# EAGLE schematic MultiDrop (EAGLE 7.6.0)
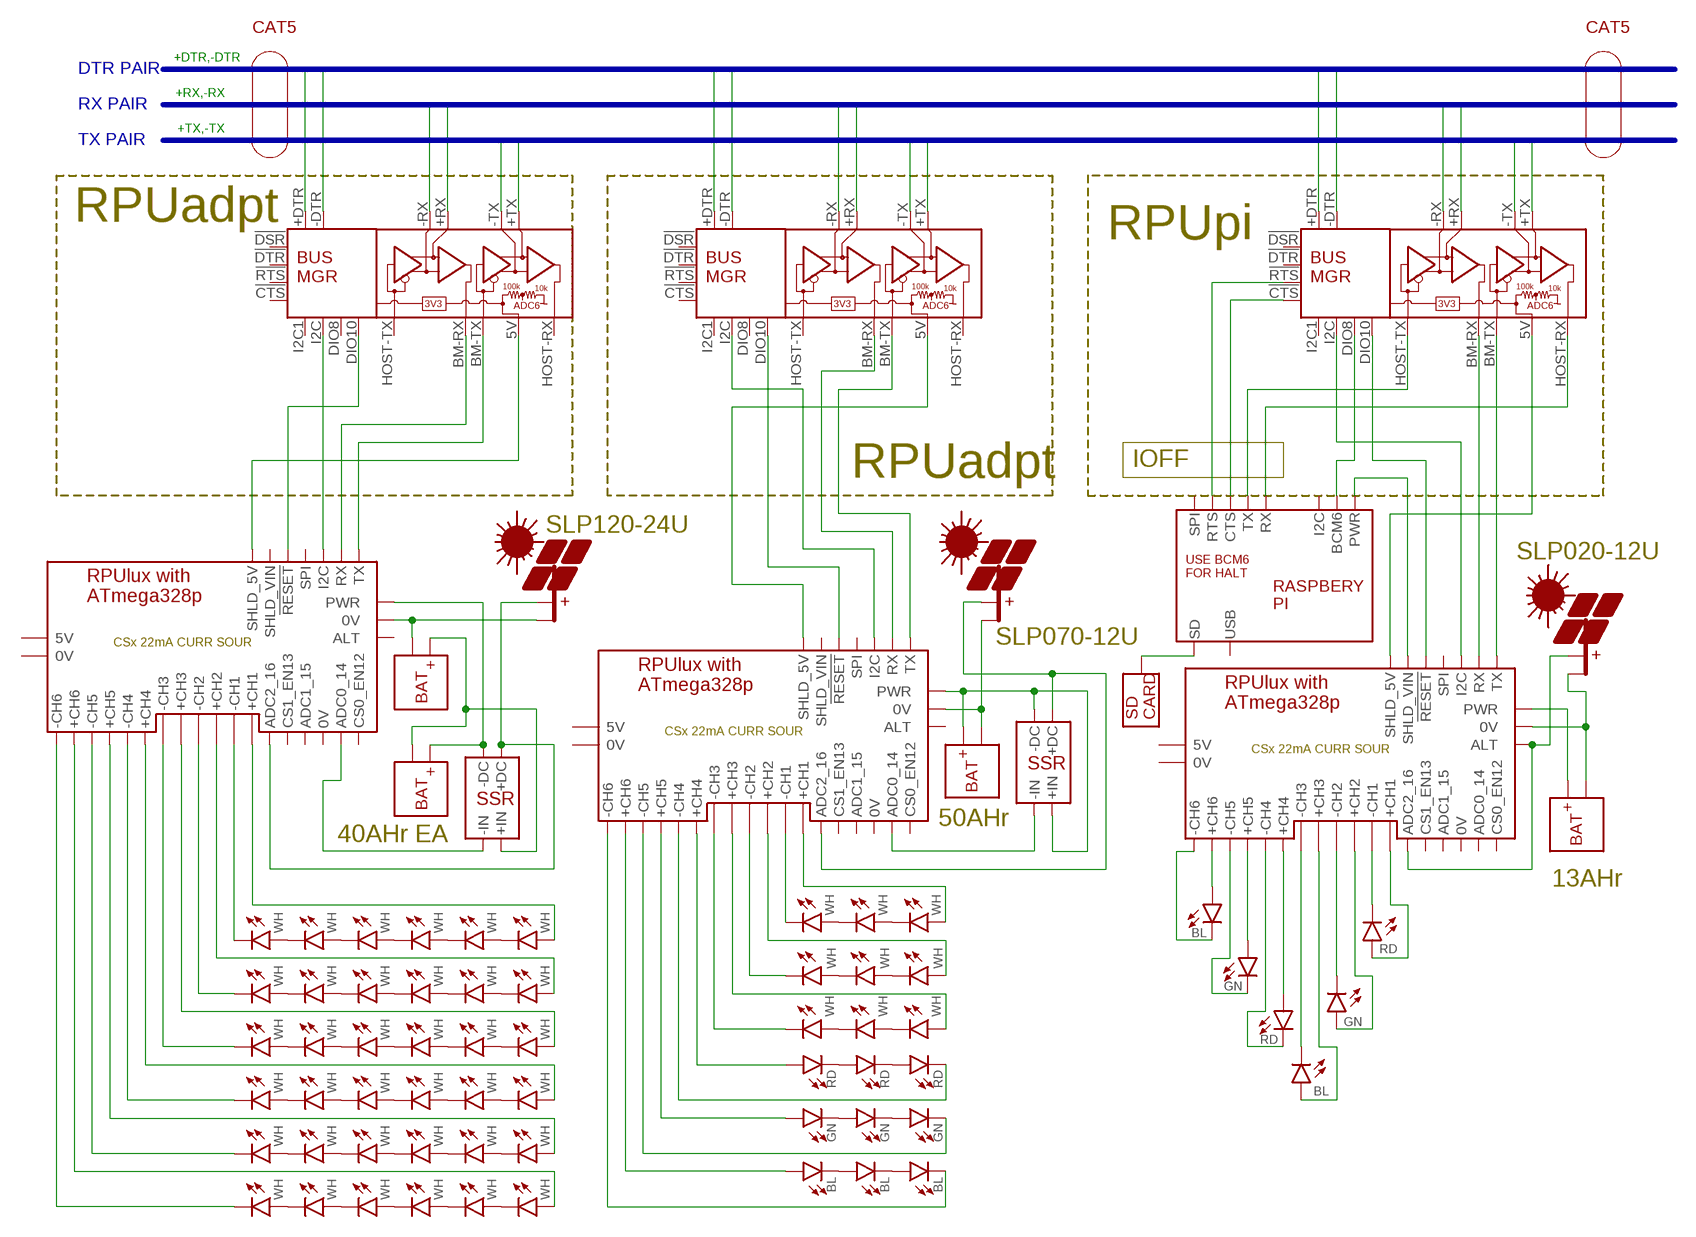
[diagram p0: schematic, sheet 1]

## Parts
B1  WH  LED5MM  [LED5MM]
B2  BL  LED5MM  [LED5MM]
B3  WH  LED5MM  [LED5MM]
B4  WH  LED5MM  [LED5MM]
BL1  GN  LED5MM  [LED5MM]
BL3  GN  LED5MM  [LED5MM]
BL4  GN  LED5MM  [LED5MM]
BL5  GN  LED5MM  [LED5MM]
G1  WH  LED5MM  [LED5MM]
G2  GN  LED5MM  [LED5MM]
G3  WH  LED5MM  [LED5MM]
G4  WH  LED5MM  [LED5MM]
GN1  BL  LED5MM  [LED5MM]
GN3  BL  LED5MM  [LED5MM]
GN4  BL  LED5MM  [LED5MM]
GN5  BL  LED5MM  [LED5MM]
PV1  PV  [NA-30]
PV2  PV  [NA-30]
PV4  PV  [NA-30]
R1  WH  LED5MM  [LED5MM]
R2  RD  LED5MM  [LED5MM]
R3  WH  LED5MM  [LED5MM]
R4  WH  LED5MM  [LED5MM]
R5  WH  LED5MM  [LED5MM]
R6  WH  LED5MM  [LED5MM]
R7  WH  LED5MM  [LED5MM]
R8  WH  LED5MM  [LED5MM]
R9  WH  LED5MM  [LED5MM]
R10  WH  LED5MM  [LED5MM]
R11  WH  LED5MM  [LED5MM]
R12  WH  LED5MM  [LED5MM]
R13  WH  LED5MM  [LED5MM]
R14  WH  LED5MM  [LED5MM]
R15  WH  LED5MM  [LED5MM]
R16  WH  LED5MM  [LED5MM]
R17  WH  LED5MM  [LED5MM]
R18  WH  LED5MM  [LED5MM]
R19  WH  LED5MM  [LED5MM]
R20  WH  LED5MM  [LED5MM]
R21  WH  LED5MM  [LED5MM]
R22  WH  LED5MM  [LED5MM]
R23  WH  LED5MM  [LED5MM]
R24  WH  LED5MM  [LED5MM]
R25  WH  LED5MM  [LED5MM]
R26  WH  LED5MM  [LED5MM]
R27  WH  LED5MM  [LED5MM]
R28  WH  LED5MM  [LED5MM]
R29  WH  LED5MM  [LED5MM]
R30  WH  LED5MM  [LED5MM]
R31  WH  LED5MM  [LED5MM]
R32  WH  LED5MM  [LED5MM]
R33  WH  LED5MM  [LED5MM]
R34  WH  LED5MM  [LED5MM]
R35  WH  LED5MM  [LED5MM]
R36  WH  LED5MM  [LED5MM]
R37  WH  LED5MM  [LED5MM]
R38  WH  LED5MM  [LED5MM]
R39  WH  LED5MM  [LED5MM]
R40  WH  LED5MM  [LED5MM]
RD1  RD  LED5MM  [LED5MM]
RD3  RD  LED5MM  [LED5MM]
RD4  RD  LED5MM  [LED5MM]
RD5  RD  LED5MM  [LED5MM]
SD2  SD  [NA-30]
U$1  BUS_MGR  [WITH_RPU_NAMES]
U$2  BUS_MGR  [WITH_RPU_NAMES]
U$3  PI  [NA-30]
U$4  BUS_MGR  [WITH_RPU_NAMES]
U$5  RPULUX  [WITH_RPU_NAMES]
U$6  RPULUX  [WITH_RPU_NAMES]
U$7  BAT  [NA-30]
U$8  RPULUX  [WITH_RPU_NAMES]
U$9  BAT  [NA-30]
U$10  BAT  [NA-30]
U$11  BAT  [NA-30]
U$12  SSR_DC  [NA-30]
U$13  SSR_DC  [NA-30]

## Nets
+DTR: U$4.+DTR
+DTR1: U$2.+DTR
+DTR3: U$1.+DTR
+RX: U$4.+RX
+RX1: U$2.+RX
+RX3: U$1.+RX
+TX: U$4.+TX
+TX1: U$2.+TX
+TX3: U$1.+TX
-DTR: U$4.-DTR
-DTR1: U$2.-DTR
-DTR3: U$1.-DTR
-RX: U$4.-RX
-RX1: U$2.-RX
-RX3: U$1.-RX
-TX: U$4.-TX
-TX1: U$2.-TX
-TX3: U$1.-TX
N$1: U$4.BM-TX(BM_TX) U$8.TX
N$2: U$4.BM-RX(BM_RX) U$8.RX
N$3: PV1.1(+PV) U$8.ADC2(ADC2_16) U$13.1(+DC)
N$5: R5.K R10.A
N$6: R8.A U$8.+CH1
N$7: R9.A R10.K
N$8: R5.A R6.K
N$9: R6.A R7.K
N$10: U$2.BM-TX(BM_TX) U$5.TX
N$11: U$2.BM-RX(BM_RX) U$5.RX
N$12: U$1.DIO8 U$3.7(BCM6)
N$13: U$1.5V(PWR) U$6.SHLD_5V
N$14: U$1.BM-TX(BM_TX) U$6.TX
N$15: U$6.PWR U$7.1(+BAT)
N$16: U$10.1(+BAT) U$11.2(-BAT) U$13.2(+IN)
N$17: R7.A R8.K
N$18: U$5.PWR U$9.1(+BAT) U$12.2(+IN) U$12.3(-DC)
N$19: R11.A R12.K
N$20: R12.A R13.K
N$21: U$1.BM-RX(BM_RX) U$6.RX
N$22: U$1.!CTS U$3.1(CTS)
N$23: U$1.!RTS U$3.2(RTS)
N$24: R13.A R14.K
N$25: GN1.A U$5.+CH6
N$26: U$1.HOST-RX(HOST_RX) U$3.3(RX)
N$27: U$1.HOST-TX(HOST_TX) U$3.4(TX)
N$28: SD2.1(PV_PWR) U$3.9(SD)
N$29: U$4.5V(PWR) U$8.SHLD_5V
N$30: U$4.DIO10 U$8.!RESET
N$31: R14.A R15.K
N$32: U$1.I2C U$6.I2C
N$33: U$4.I2C U$8.I2C
N$34: R15.A R16.K
N$35: R16.A U$8.+CH2
N$36: GN3.A U$6.+CH6
N$37: R11.K U$8.-CH2
N$38: U$8.PWR U$11.1(+BAT) U$13.3(-DC)
N$39: PV2.2(-PV) U$5.0V@PWR(0V) U$9.2(-BAT)
N$40: RD3.A
N$41: U$3.12(PWR) U$6.SHLD_VOUT(SHLD_VIN)
N$42: PV4.2(-PV) U$6.0V@PWR(0V) U$7.2(-BAT)
N$43: U$1.DIO10 U$6.!RESET
N$44: U$2.DIO10 U$5.!RESET
N$45: U$2.5V(PWR) U$5.SHLD_5V
N$46: RD3.K
N$47: BL3.A
N$48: U$2.I2C U$5.I2C
N$49: BL3.K
N$50: PV4.1(+PV) U$6.ADC2(ADC2_16) U$6.AUX(ALT)
N$51: GN3.K
N$52: RD1.A U$5.+CH4
N$53: RD5.K U$5.-CH4
N$54: BL1.A U$5.+CH5
N$55: BL5.K U$5.-CH5
N$56: R1.A R3.K
N$57: GN5.K U$5.-CH6
N$58: R1.K U$5.-CH1
N$59: R4.A U$5.+CH1
N$60: G4.A U$5.+CH2
N$61: G1.K U$5.-CH2
N$62: B4.A U$5.+CH3
N$63: B1.K U$5.-CH3
N$64: R2.K
N$65: R2.A
N$66: G2.A
N$67: G2.K
N$68: B2.A
N$69: B2.K
N$70: R3.A R4.K
N$71: G3.A G4.K
N$72: G1.A G3.K
N$73: B3.A B4.K
N$74: B1.A B3.K
N$75: GN1.K GN4.A
N$76: GN4.K GN5.A
N$77: BL1.K BL4.A
N$78: BL4.K BL5.A
N$79: RD1.K RD4.A
N$80: RD4.K RD5.A
N$81: PV2.1(+PV) U$5.ADC2(ADC2_16) U$12.1(+DC)
N$82: U$5.ADC0(ADC0_14) U$12.4(-IN)
N$83: R17.K R21.A
N$84: R18.K R22.A
N$85: R19.K R23.A
N$86: R9.K U$8.-CH1
N$87: R20.K R24.A
N$88: R21.K R25.A
N$89: R22.K R26.A
N$90: R23.K R27.A
N$91: R24.K R28.A
N$92: R25.K R29.A
N$93: R26.K R30.A
N$94: R27.K R31.A
N$95: R28.K R32.A
N$96: R29.K R33.A
N$97: R30.K R34.A
N$98: R31.K R35.A
N$99: R32.K R36.A
N$100: R33.K R37.A
N$101: R34.K R38.A
N$102: R35.K R39.A
N$103: R36.K R40.A
N$104: R17.A U$8.+CH3
N$105: R37.K U$8.-CH3
N$106: R18.A U$8.+CH4
N$107: R38.K U$8.-CH4
N$108: R19.A U$8.+CH5
N$109: R39.K U$8.-CH5
N$110: R20.A U$8.+CH6
N$111: R40.K U$8.-CH6
N$112: PV1.2(-PV) U$8.0V@PWR(0V) U$10.2(-BAT)
N$113: U$8.ADC0(ADC0_14) U$13.4(-IN)
Unconnected: U$1.!DSR U$1.!DTR U$1.I2C1 U$2.!CTS U$2.!DSR U$2.!DTR U$2.!RTS U$2.DIO8 U$2.HOST-RX(HOST_RX) U$2.HOST-TX(HOST_TX) U$2.I2C1 U$3.8(I2C) U$3.10(SPI) U$3.11(USB) U$4.!CTS U$4.!DSR U$4.!DTR U$4.!RTS U$4.DIO8 U$4.HOST-RX(HOST_RX) U$4.HOST-TX(HOST_TX) U$4.I2C1 U$5.0V U$5.0V@DIO2(0V) U$5.5V U$5.22MA@ADC0(CS0_EN12) U$5.22MA@ADC1(CS1_EN13) U$5.ADC1(ADC1_15) U$5.AUX(ALT) U$5.SHLD_VOUT(SHLD_VIN) U$5.SPI U$6.0V U$6.0V@DIO2(0V) U$6.5V U$6.22MA@ADC0(CS0_EN12) U$6.22MA@ADC1(CS1_EN13) U$6.+CH1 U$6.+CH2 U$6.+CH3 U$6.+CH4 U$6.+CH5 U$6.-CH1 U$6.-CH2 U$6.-CH3 U$6.-CH4 U$6.-CH5 U$6.-CH6 U$6.ADC0(ADC0_14) U$6.ADC1(ADC1_15) U$6.SPI U$8.0V U$8.0V@DIO2(0V) U$8.5V U$8.22MA@ADC0(CS0_EN12) U$8.22MA@ADC1(CS1_EN13) U$8.ADC1(ADC1_15) U$8.AUX(ALT) U$8.SHLD_VOUT(SHLD_VIN) U$8.SPI

## Buses
+DTR,-DTR
+RX,-RX
+TX,-TX

## Notes on the sheet
- CAT5 | CAT5
- DTR PAIR
- RX PAIR
- TX PAIR
- RPUadpt
- RPUpi
- IOFF
- RPUadpt
- SLP120-24U
- SLP020-12U
- SLP070-12U
- 50AHr
- 40AHr EA
- 13AHr

## Library data of the parts
B1-B4 BL1 BL3-BL5 G1-G4 GN1 GN3-GN5 R1-R40 RD1 RD3-RD5 = D-LED:LED: LED 120120WH [CREE,XHGAWT-00-0000-00000HXE1] LED WHITE 6500K 150LUM-W120120
PV1 PV2 PV4 = Documentation:PV
SD2 = Documentation:SD
U$1 U$2 U$4 = Documentation:BUS_MGR: RPU BUS MANAGER
U$3 = Documentation:PI: Raspbery Pi
U$5 U$6 U$8 = Documentation:RPULUX
U$7 U$9-U$11 = Documentation:BAT
U$12 U$13 = Documentation:SSR_DC: Crydom DR06D06 din mount 6A 4..32VIN 60Vload